# Altium schematic sheet FPGA_PWR.SchDoc: TE0722
size A4; Organization: Trenz Electronic GmbH; DocumentNumber: 6; Revision: 01; SheetNumber: 6; SheetTotal: 8; Date: 07.11.2014; PageSetup: Record=PageOptions|CenterHorizontal=True|CenterVertical=True|PrintScale=0.96|XCorrection=1.00|YCorrection=1.00|PrintKind=0|BorderSize=5000000|LeftOffset=0|BottomOffset=0|Orientation=2|PaperLength=1000|PaperWidth=1000|Scale=100|PaperSource=7|PrintQuality=-4|MediaType=1|DitherType=10|PaperKind=A4|PrintScaleMode=1
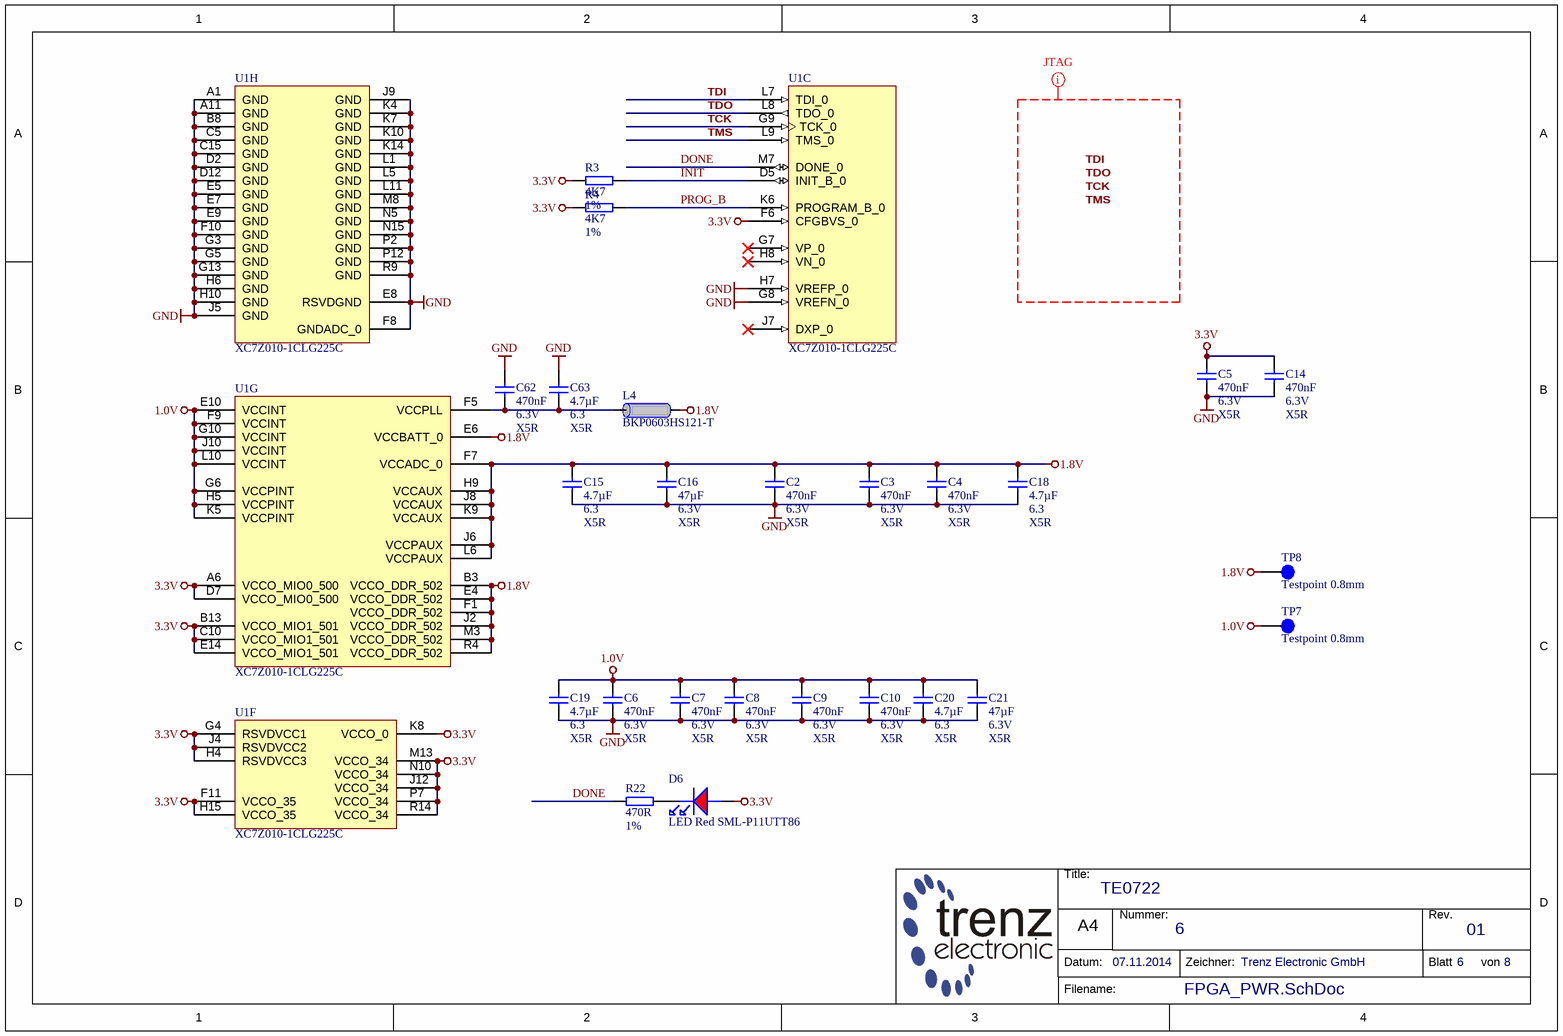
[diagram p0: FPGA_PWR.SchDoc]

## Parts
C2  470nF  Voltage: 6.3V  Technology: X5R  [CAPC0603X33N]
C3  470nF  Voltage: 6.3V  Technology: X5R  [CAPC0603X33N]
C4  470nF  Voltage: 6.3V  Technology: X5R  [CAPC0603X33N]
C5  470nF  Voltage: 6.3V  Technology: X5R  [CAPC0603X33N]
C6  470nF  Voltage: 6.3V  Technology: X5R  [CAPC0603X33N]
C7  470nF  Voltage: 6.3V  Technology: X5R  [CAPC0603X33N]
C8  470nF  Voltage: 6.3V  Technology: X5R  [CAPC0603X33N]
C9  470nF  Voltage: 6.3V  Technology: X5R  [CAPC0603X33N]
C10  470nF  Voltage: 6.3V  Technology: X5R  [CAPC0603X33N]
C14  470nF  Voltage: 6.3V  Technology: X5R  [CAPC0603X33N]
C15  4.7µF  Voltage: 6.3  Technology: X5R  [CAPC1005X60N]
C16  47µF  Voltage: 6.3V  Technology: X5R  [CAPC2012X135N]
C18  4.7µF  Voltage: 6.3  Technology: X5R  [CAPC1005X60N]
C19  4.7µF  Voltage: 6.3  Technology: X5R  [CAPC1005X60N]
C20  4.7µF  Voltage: 6.3  Technology: X5R  [CAPC1005X60N]
C21  47µF  Voltage: 6.3V  Technology: X5R  [CAPC2012X135N]
C62  470nF  Voltage: 6.3V  Technology: X5R  [CAPC0603X33N]
C63  4.7µF  Voltage: 6.3  Technology: X5R  [CAPC1005X60N]
D6  LED Red SML-P11UTT86  [LEDC1006X25N_RED]
L4  BKP0603HS121-T  [INDC0603X33N]
R3  4K7  Tolerance: 1%  [RESC0603X26N]
R4  4K7  Tolerance: 1%  [RESC0603X26N]
R22  470R  Tolerance: 1%  [RESC1005X40N]
TP7  Testpoint 0.8mm  [TP_0.8mm]
TP8  Testpoint 0.8mm  [TP_0.8mm]
U1  XC7Z010-1CLG225C  [CLG225]  (parts C,F,G,H of 8)

## Nets
1.0V: C6.2 C7.2 C8.2 C9.2 C10.2 C19.1 C20.1 C21.1 TP7.1 U1.E10(VCCINT) U1.F9(VCCINT) U1.G6(VCCPINT) U1.G10(VCCINT) U1.H5(VCCPINT) U1.J10(VCCINT) U1.K5(VCCPINT) U1.L10(VCCINT)
1.8V: C2.2 C3.1 C4.2 C15.1 C16.1 C18.1 L4.1 TP8.1 U1.B3(VCCO_DDR_502) U1.E4(VCCO_DDR_502) U1.E6(VCCBATT_0) U1.F1(VCCO_DDR_502) U1.F7(VCCADC_0) U1.H9(VCCAUX) U1.J2(VCCO_DDR_502) U1.J6(VCCPAUX) U1.J8(VCCAUX) U1.K9(VCCAUX) U1.L6(VCCPAUX) U1.M3(VCCO_DDR_502) U1.R4(VCCO_DDR_502)
3.3V: C5.2 C14.2 D6.A R3.2 R4.2 U1.A6(VCCO_MIO0_500) U1.B13(VCCO_MIO1_501) U1.C10(VCCO_MIO1_501) U1.D7(VCCO_MIO0_500) U1.E14(VCCO_MIO1_501) U1.F6(CFGBVS_0) U1.F11(VCCO_35) U1.G4(RSVDVCC1) U1.H4(RSVDVCC3) U1.H15(VCCO_35) U1.J4(RSVDVCC2) U1.J12(VCCO_34) U1.K8(VCCO_0) U1.M13(VCCO_34) U1.N10(VCCO_34) U1.P7(VCCO_34) U1.R14(VCCO_34)
GND: C2.1 C3.2 C4.1 C5.1 C6.1 C7.1 C8.1 C9.1 C10.1 C14.1 C15.2 C16.2 C18.2 C19.2 C20.2 C21.2 C62.1 C63.1 U1.A1(GND) U1.A11(GND) U1.B8(GND) U1.C5(GND) U1.C15(GND) U1.D2(GND) U1.D12(GND) U1.E5(GND) U1.E7(GND) U1.E8(RSVDGND) U1.E9(GND) U1.F8(GNDADC_0) U1.F10(GND) U1.G3(GND) U1.G5(GND) U1.G8(VREFN_0) U1.G13(GND) U1.H6(GND) U1.H7(VREFP_0) U1.H10(GND) U1.J5(GND) U1.J9(GND) U1.K4(GND) U1.K7(GND) U1.K10(GND) U1.K14(GND) U1.L1(GND) U1.L5(GND) U1.L11(GND) U1.M8(GND) U1.N5(GND) U1.N15(GND) U1.P2(GND) U1.P12(GND) U1.R9(GND)
DONE: R22.2 U1.M7(DONE_0)
INIT: R3.1 U1.D5(INIT_B_0)
PROG_B: R4.1 U1.K6(PROGRAM_B_0)
TCK: U1.G9(TCK_0)
TDI: U1.L7(TDI_0)
TDO: U1.L8(TDO_0)
TMS: U1.L9(TMS_0)
NetC62_2: C62.2 C63.2 L4.2 U1.F5(VCCPLL)
NetD6_K: D6.K R22.1

Not connected (* = marked no-connect by the designer): U1 G7(VP_0)* H8(VN_0)* J7(DXP_0)*

## Layout directives
net class JTAG: TCK, TDI, TDO, TMS

## Notes on the sheet
- Labels drawn without touching a wire or pin: TCK, TDI, TDO, TMS
- Title:
- Nummer:
- Rev.
- Datum:
- A4
- Zeichner:
- Blatt
- von
- Filename:

## Library data of the parts
C2-C10 C14 = 24921: KON 470nF X5R 6.3V SMD 20%; AN: 24921; Value: 470n; Mixed: SMT; Preferred: Yes; Case: 0603 (0201); Tolerance: 20%
C15 C18-C20 C63 = 24719: KON 4.7µF 6.3V X5R SMD 20%; AN: 24719; Mixed: SMT; Value: 4.7u; Preferred: Yes; Case: 1005 (0402); Tolerance: 20%
C16 C21 = 24718: KON 47µF 6,3V  X5R SMD 20%; AN: 24718; Mixed: SMT; Value: 47u; Preferred: Yes; Case: 2012 (0805); Tolerance: 20%
C62 = 24921: KON 470nF X5R 6.3V SMD 20%; AN: 24921; Mixed: SMT; Value: 470n; Preferred: Yes; Case: 0603 (0201); Tolerance: 20%
D6 = 24212: LED Rot SML-P11UTT86 SMD; AN: 24212; Mixed: SMT; Preferred: Yes; Case: 1005 (0402); HelpURL: B:\AD\adlib\datasheet\SML-P1
L4 = 25393: Ferritdurchführung SMD 0201; AN: 25393; Trenz-Stock: Yes; Mixed: SMT; Tolerance: 25%; Case: 0603 (0201); HelpURL: B:\AD\adlib\datasheet\MULTILAYER CHIP BEAD INDUCTORS BK; Preferred: Yes
R3 R4 = 25242: WID SMD 4K7 1% 0,05W; AN: 25242; Value: 4.7K; Mixed: SMT; Preferred: Yes; Case: 0603 (0201); HelpURL: B:\AD\adlib\datasheet\R0201
R22 = 22769: WID SMD 470R 1% 0,063W; AN: 22769; Value: 470; Mixed: SMT; Preferred: Yes; Case: 1005 (0402)
TP7 TP8 = 26289: AN: 26289; Mixed: 1
U1 = 26308: AN: 26308; Mixed: SMT; Case: CLG225; HelpURL: B:\AD\adlib\datasheet\XC7\Zynq